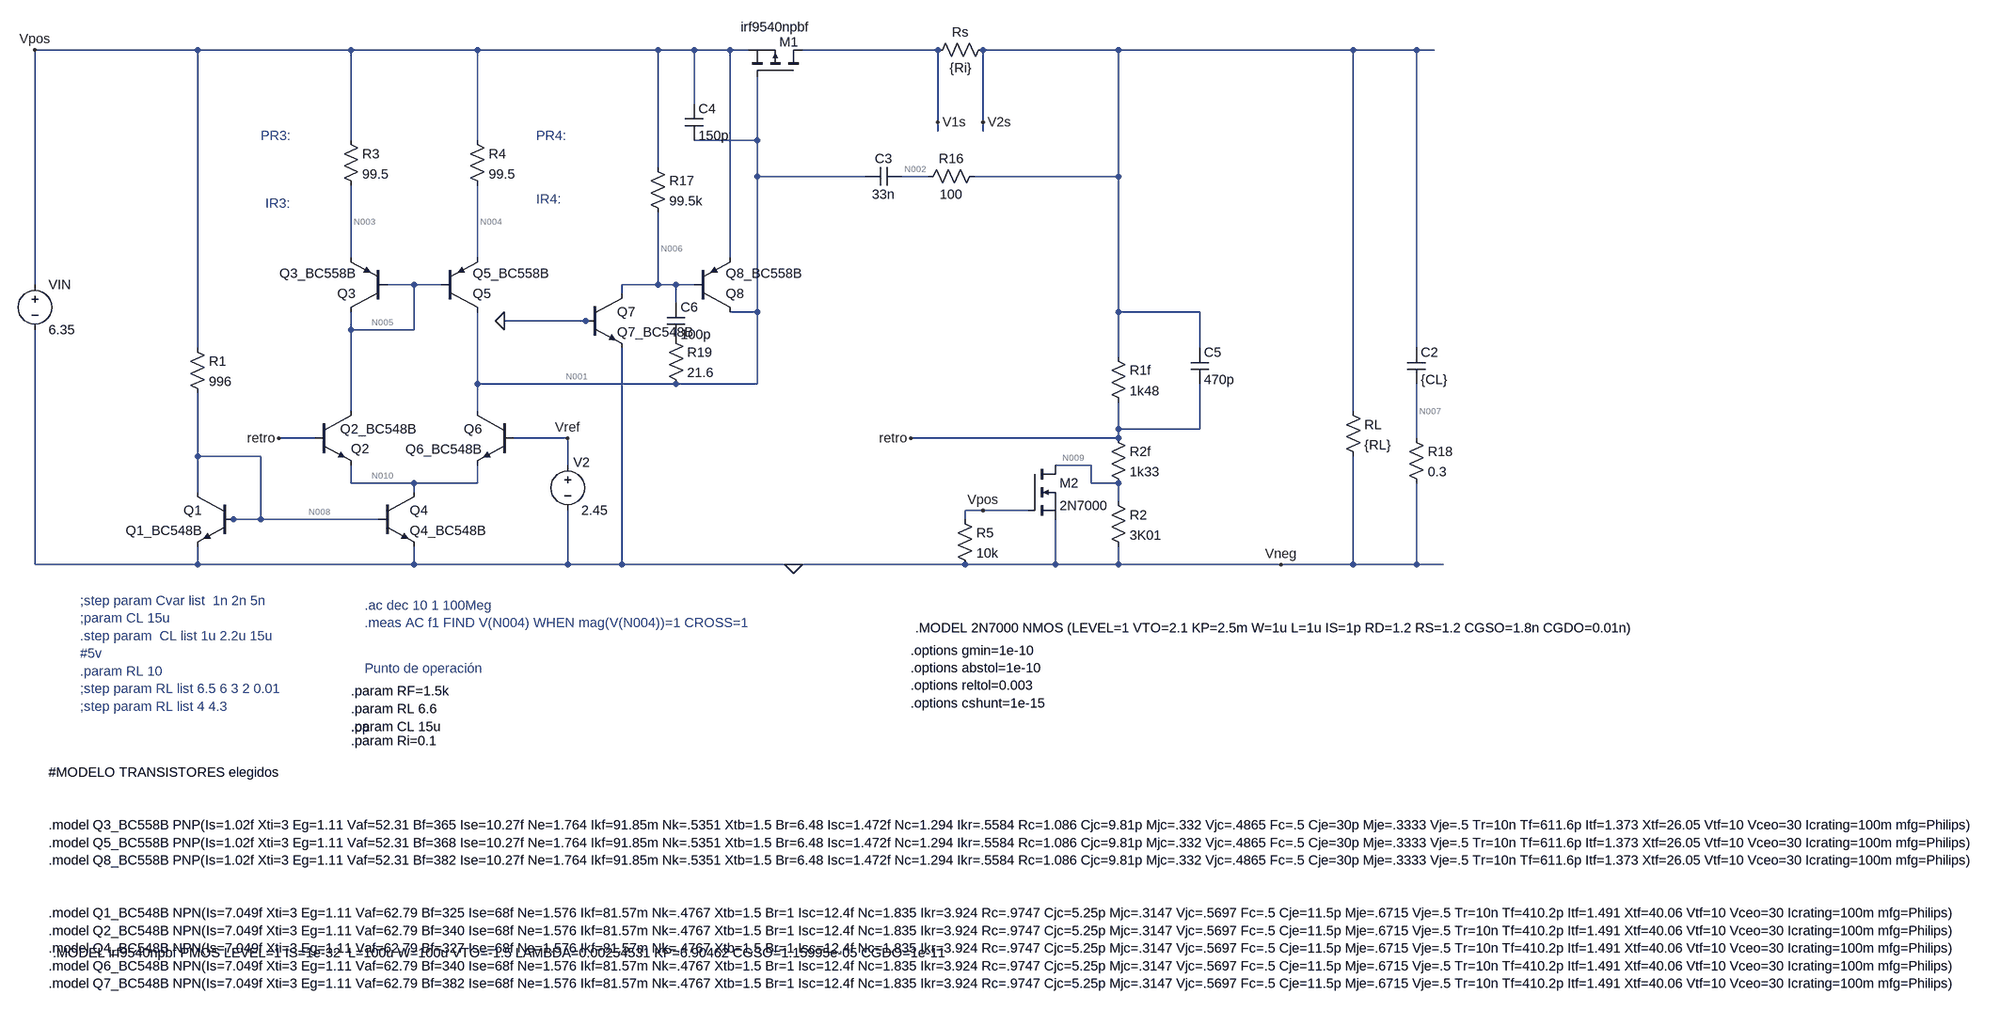
[diagram p0: schematic 2024-10-27 prueba vref caso limite.asc]
2024-10-27 prueba vref caso limite.asc, the LTspice schematic file:
Version 4
SHEET 1 6700 2000
WIRE -496 -32 -784 -32
WIRE -224 -32 -496 -32
WIRE 0 -32 -224 -32
WIRE 320 -32 0 -32
WIRE 384 -32 320 -32
WIRE 448 -32 384 -32
WIRE 480 -32 448 -32
WIRE 816 -32 576 -32
WIRE 1136 -32 896 -32
WIRE 1552 -32 1136 -32
WIRE 1664 -32 1552 -32
WIRE 1696 -32 1664 -32
WIRE 384 64 384 -32
WIRE 816 96 816 -32
WIRE 896 96 896 -32
WIRE 816 112 816 96
WIRE 896 112 896 96
WIRE -224 128 -224 -32
WIRE 0 128 0 -32
WIRE 496 128 496 16
WIRE 496 128 384 128
WIRE 320 176 320 -32
WIRE 496 192 496 128
WIRE 688 192 496 192
WIRE 800 192 752 192
WIRE 1136 192 1136 -32
WIRE 1136 192 880 192
WIRE -224 336 -224 208
WIRE 0 336 0 208
WIRE 448 336 448 -32
WIRE -784 384 -784 -32
WIRE -112 384 -160 384
WIRE -64 384 -112 384
WIRE 320 384 320 256
WIRE 320 384 256 384
WIRE 352 384 320 384
WIRE 384 384 352 384
WIRE 256 400 256 384
WIRE 352 416 352 384
WIRE 496 432 496 192
WIRE 496 432 448 432
WIRE 1136 432 1136 192
WIRE 1280 432 1136 432
WIRE 192 448 48 448
WIRE 208 448 192 448
WIRE -224 464 -224 432
WIRE -112 464 -112 384
WIRE -112 464 -224 464
WIRE -496 496 -496 -32
WIRE 1280 496 1280 432
WIRE 1664 496 1664 -32
WIRE 1136 512 1136 432
WIRE 0 560 0 432
WIRE 352 560 0 560
WIRE 496 560 496 432
WIRE 496 560 352 560
WIRE -224 608 -224 464
WIRE 0 608 0 560
WIRE 1552 608 1552 -32
WIRE 1136 640 1136 592
WIRE 1280 640 1280 560
WIRE 1280 640 1136 640
WIRE -288 656 -352 656
WIRE 160 656 64 656
WIRE 1136 656 1136 640
WIRE 1136 656 768 656
WIRE 1664 656 1664 560
WIRE -496 688 -496 576
WIRE -384 688 -496 688
WIRE 160 704 160 656
WIRE 1088 704 1024 704
WIRE -224 736 -224 704
WIRE -112 736 -224 736
WIRE 0 736 0 704
WIRE 0 736 -112 736
WIRE 1088 736 1088 704
WIRE 1136 736 1088 736
WIRE -496 752 -496 688
WIRE -112 752 -112 736
WIRE 1136 768 1136 736
WIRE 896 784 864 784
WIRE 976 784 896 784
WIRE -432 800 -448 800
WIRE -384 800 -384 688
WIRE -384 800 -432 800
WIRE -176 800 -384 800
WIRE 864 800 864 784
WIRE -784 880 -784 464
WIRE -496 880 -496 848
WIRE -496 880 -784 880
WIRE -112 880 -112 848
WIRE -112 880 -496 880
WIRE 160 880 160 784
WIRE 160 880 -112 880
WIRE 256 880 256 496
WIRE 256 880 160 880
WIRE 560 880 256 880
WIRE 864 880 560 880
WIRE 1024 880 1024 800
WIRE 1024 880 864 880
WIRE 1136 880 1136 848
WIRE 1136 880 1024 880
WIRE 1424 880 1136 880
WIRE 1552 880 1552 688
WIRE 1552 880 1424 880
WIRE 1664 880 1664 736
WIRE 1664 880 1552 880
WIRE 1712 880 1664 880
FLAG 560 880 0
FLAG -784 -32 Vpos
FLAG 816 96 V1s
FLAG 896 96 V2s
FLAG 1424 880 Vneg
FLAG 160 656 Vref
FLAG -352 656 retro
FLAG 768 656 retro
FLAG 48 448 0
FLAG 896 784 Vpos
DATAFLAG 96 -32 ""
DATAFLAG 1152 -32 ""
DATAFLAG 1152 -32 ""
DATAFLAG 1152 -32 ""
DATAFLAG -112 736 ""
DATAFLAG 160 560 ""
DATAFLAG 1136 640 ""
DATAFLAG 992 560 "(V(v2s)-V(retro))*I(R1f)"
DATAFLAG -352 176 "(V(vpos)-V(n004))*I(R3)"
DATAFLAG 160 176 "(V(vpos)-V(n004))*I(R4)"
DATAFLAG 848 -96 "(V(v2s)-V(v1s))*I(Rs)"
DATAFLAG 1456 672 "V(v2s)*I(RL)"
DATAFLAG 544 -96 "(-V(v2s)+V(vpos))*Is(M1)"
DATAFLAG -624 560 "(V(vpos)-V(n008))*I(R1)"
DATAFLAG 160 288 "-Ic(Q5)"
DATAFLAG -352 288 "-Ic(Q3)"
DATAFLAG 768 784 ""
SYMBOL res 1536 592 R0
SYMATTR InstName RL
SYMATTR Value {RL}
SYMBOL voltage -784 368 R0
WINDOW 123 24 124 Left 2
WINDOW 39 0 0 Left 0
SYMATTR InstName VIN
SYMATTR Value 6.35
SYMBOL res 1120 496 R0
SYMATTR InstName R1f
SYMATTR Value 1k48
SYMBOL res 1120 640 R0
SYMATTR InstName R2f
SYMATTR Value 1k33
SYMBOL res 912 -48 R90
WINDOW 0 0 56 VBottom 2
WINDOW 3 32 56 VTop 2
SYMATTR InstName Rs
SYMATTR Value {Ri}
SYMBOL pnp -160 432 R180
SYMATTR InstName Q3
SYMATTR Value Q3_BC558B
SYMBOL pnp -64 432 M180
SYMATTR InstName Q5
SYMATTR Value Q5_BC558B
SYMBOL npn -288 608 R0
WINDOW 0 64 67 Left 2
WINDOW 3 45 32 Left 2
SYMATTR InstName Q2
SYMATTR Value Q2_BC548B
SYMBOL npn 64 608 M0
SYMATTR InstName Q6
SYMATTR Value Q6_BC548B
SYMBOL res -240 112 R0
SYMATTR InstName R3
SYMATTR Value 99.5
SYMBOL res -16 112 R0
SYMATTR InstName R4
SYMATTR Value 99.5
SYMBOL res -512 480 R0
SYMATTR InstName R1
SYMATTR Value 996
SYMBOL npn -432 752 M0
SYMATTR InstName Q1
SYMATTR Value Q1_BC548B
SYMBOL npn -176 752 R0
SYMATTR InstName Q4
SYMATTR Value Q4_BC548B
SYMBOL pmos 576 16 M270
WINDOW 0 62 41 VLeft 2
WINDOW 3 89 109 VLeft 2
SYMATTR InstName M1
SYMATTR Value irf9540npbf
SYMBOL voltage 160 688 R0
WINDOW 0 10 11 Left 2
SYMATTR InstName V2
SYMATTR Value 2.45
SYMBOL pnp 384 432 M180
SYMATTR InstName Q8
SYMATTR Value Q8_BC558B
SYMBOL npn 192 400 R0
SYMATTR InstName Q7
SYMATTR Value Q7_BC548B
SYMBOL res 304 160 R0
SYMATTR InstName R17
SYMATTR Value 99.5k
SYMBOL cap 1648 496 R0
SYMATTR InstName C2
SYMATTR Value {CL}
SYMBOL cap 752 176 R90
WINDOW 0 0 32 VBottom 2
WINDOW 3 32 32 VTop 2
SYMATTR InstName C3
SYMATTR Value 33n
SYMBOL res 896 176 R90
WINDOW 0 0 56 VBottom 2
WINDOW 3 32 56 VTop 2
SYMATTR InstName R16
SYMATTR Value 100
SYMBOL cap 368 64 R0
SYMATTR InstName C4
SYMATTR Value 150p
SYMBOL cap 1264 496 R0
SYMATTR InstName C5
SYMATTR Value 470p
SYMBOL res 1648 640 R0
SYMATTR InstName R18
SYMATTR Value 0.3
SYMBOL cap 336 416 R0
SYMATTR InstName C6
SYMATTR Value 100p
SYMBOL res 336 464 R0
SYMATTR InstName R19
SYMATTR Value 21.6
SYMBOL nmos 976 704 R0
SYMATTR InstName M2
SYMATTR Value 2N7000
SYMBOL res 1120 752 R0
SYMATTR InstName R2
SYMATTR Value 3K01
SYMBOL res 848 784 R0
SYMATTR InstName R5
SYMATTR Value 10k
TEXT -224 1168 Left 2 !.op
TEXT -752 1568 Left 2 !.MODEL irf9540npbf PMOS LEVEL=1 IS=1e-32  L=100u W=100u VTO=-1.5 LAMBDA=0.00254531 KP=6.90462 CGSO=1.15995e-05 CGDO=1e-11
TEXT -224 1136 Left 2 !.param RL 6.6\n.param CL 15u
TEXT -224 1104 Left 2 !.param RF=1.5k
TEXT -200 1064 Left 2 ;Punto de operación
TEXT -224 1192 Left 2 !.param Ri=0.1
TEXT -760 1248 Left 2 !#MODELO TRANSISTORES elegidos\n \n\n.model Q3_BC558B PNP(Is=1.02f Xti=3 Eg=1.11 Vaf=52.31 Bf=365 Ise=10.27f Ne=1.764 Ikf=91.85m Nk=.5351 Xtb=1.5 Br=6.48 Isc=1.472f Nc=1.294 Ikr=.5584 Rc=1.086 Cjc=9.81p Mjc=.332 Vjc=.4865 Fc=.5 Cje=30p Mje=.3333 Vje=.5 Tr=10n Tf=611.6p Itf=1.373 Xtf=26.05 Vtf=10 Vceo=30 Icrating=100m mfg=Philips)\n.model Q5_BC558B PNP(Is=1.02f Xti=3 Eg=1.11 Vaf=52.31 Bf=368 Ise=10.27f Ne=1.764 Ikf=91.85m Nk=.5351 Xtb=1.5 Br=6.48 Isc=1.472f Nc=1.294 Ikr=.5584 Rc=1.086 Cjc=9.81p Mjc=.332 Vjc=.4865 Fc=.5 Cje=30p Mje=.3333 Vje=.5 Tr=10n Tf=611.6p Itf=1.373 Xtf=26.05 Vtf=10 Vceo=30 Icrating=100m mfg=Philips)\n.model Q8_BC558B PNP(Is=1.02f Xti=3 Eg=1.11 Vaf=52.31 Bf=382 Ise=10.27f Ne=1.764 Ikf=91.85m Nk=.5351 Xtb=1.5 Br=6.48 Isc=1.472f Nc=1.294 Ikr=.5584 Rc=1.086 Cjc=9.81p Mjc=.332 Vjc=.4865 Fc=.5 Cje=30p Mje=.3333 Vje=.5 Tr=10n Tf=611.6p Itf=1.373 Xtf=26.05 Vtf=10 Vceo=30 Icrating=100m mfg=Philips)\n \n\n.model Q1_BC548B NPN(Is=7.049f Xti=3 Eg=1.11 Vaf=62.79 Bf=325 Ise=68f Ne=1.576 Ikf=81.57m Nk=.4767 Xtb=1.5 Br=1 Isc=12.4f Nc=1.835 Ikr=3.924 Rc=.9747 Cjc=5.25p Mjc=.3147 Vjc=.5697 Fc=.5 Cje=11.5p Mje=.6715 Vje=.5 Tr=10n Tf=410.2p Itf=1.491 Xtf=40.06 Vtf=10 Vceo=30 Icrating=100m mfg=Philips)\n.model Q2_BC548B NPN(Is=7.049f Xti=3 Eg=1.11 Vaf=62.79 Bf=340 Ise=68f Ne=1.576 Ikf=81.57m Nk=.4767 Xtb=1.5 Br=1 Isc=12.4f Nc=1.835 Ikr=3.924 Rc=.9747 Cjc=5.25p Mjc=.3147 Vjc=.5697 Fc=.5 Cje=11.5p Mje=.6715 Vje=.5 Tr=10n Tf=410.2p Itf=1.491 Xtf=40.06 Vtf=10 Vceo=30 Icrating=100m mfg=Philips)\n.model Q4_BC548B NPN(Is=7.049f Xti=3 Eg=1.11 Vaf=62.79 Bf=327 Ise=68f Ne=1.576 Ikf=81.57m Nk=.4767 Xtb=1.5 Br=1 Isc=12.4f Nc=1.835 Ikr=3.924 Rc=.9747 Cjc=5.25p Mjc=.3147 Vjc=.5697 Fc=.5 Cje=11.5p Mje=.6715 Vje=.5 Tr=10n Tf=410.2p Itf=1.491 Xtf=40.06 Vtf=10 Vceo=30 Icrating=100m mfg=Philips)\n.model Q6_BC548B NPN(Is=7.049f Xti=3 Eg=1.11 Vaf=62.79 Bf=340 Ise=68f Ne=1.576 Ikf=81.57m Nk=.4767 Xtb=1.5 Br=1 Isc=12.4f Nc=1.835 Ikr=3.924 Rc=.9747 Cjc=5.25p Mjc=.3147 Vjc=.5697 Fc=.5 Cje=11.5p Mje=.6715 Vje=.5 Tr=10n Tf=410.2p Itf=1.491 Xtf=40.06 Vtf=10 Vceo=30 Icrating=100m mfg=Philips)\n.model Q7_BC548B NPN(Is=7.049f Xti=3 Eg=1.11 Vaf=62.79 Bf=382 Ise=68f Ne=1.576 Ikf=81.57m Nk=.4767 Xtb=1.5 Br=1 Isc=12.4f Nc=1.835 Ikr=3.924 Rc=.9747 Cjc=5.25p Mjc=.3147 Vjc=.5697 Fc=.5 Cje=11.5p Mje=.6715 Vje=.5 Tr=10n Tf=410.2p Itf=1.491 Xtf=40.06 Vtf=10 Vceo=30 Icrating=100m mfg=Philips)
TEXT -200 952 Left 2 ;.ac dec 10 1 100Meg\n.meas AC f1 FIND V(N004) WHEN mag(V(N004))=1 CROSS=1
TEXT -704 944 Left 2 ;;step param Cvar list  1n 2n 5n\n;param CL 15u\n.step param  CL list 1u 2.2u 15u\n#5v\n.param RL 10\n;step param RL list 6.5 6 3 2 0.01\n;step param RL list 4 4.3
TEXT 768 1032 Left 2 !.options gmin=1e-10\n.options abstol=1e-10\n.options reltol=0.003\n.options cshunt=1e-15
TEXT -384 120 Left 2 ;PR3:
TEXT -376 240 Left 2 ;IR3:
TEXT 104 120 Left 2 ;PR4:
TEXT 104 232 Left 2 ;IR4:
TEXT 776 992 Left 2 !.MODEL 2N7000 NMOS (LEVEL=1 VTO=2.1 KP=2.5m W=1u L=1u IS=1p RD=1.2 RS=1.2 CGSO=1.8n CGDO=0.01n)

The netlist it stands for:
* 2024-10-27 prueba vref caso limite.asc
RL V2s 0 {RL}
VIN Vpos 0 6.35
R1f V2s retro 1k48
R2f retro N009 1k33
Rs V2s V1s {Ri}
Q3 N005 N005 N003 0 Q3_BC558B
Q5 N001 N005 N004 0 Q5_BC558B
Q2 N005 retro N010 0 Q2_BC548B
Q6 N001 Vref N010 0 Q6_BC548B
R3 Vpos N003 99.5
R4 Vpos N004 99.5
R1 Vpos N008 996
Q1 N008 N008 0 0 Q1_BC548B
Q4 N010 N008 0 0 Q4_BC548B
M1 V1s N001 Vpos Vpos irf9540npbf
V2 Vref 0 2.45
Q8 N001 N006 Vpos 0 Q8_BC558B
Q7 N006 0 0 0 Q7_BC548B
R17 Vpos N006 99.5k
C2 V2s N007 {CL}
C3 N002 N001 33n
R16 V2s N002 100
C4 Vpos N001 150p
C5 V2s retro 470p
R18 N007 0 0.3
C6 N006 P001 100p
R19 P001 N001 21.6
M2 N009 Vpos 0 0 2N7000
R2 N009 0 3K01
R5 Vpos 0 10k
.model NPN NPN
.model PNP PNP
.lib standard.bjt
.model NMOS NMOS
.model PMOS PMOS
.lib standard.mos
.op
.MODEL irf9540npbf PMOS LEVEL=1 IS=1e-32  L=100u W=100u VTO=-1.5 LAMBDA=0.00254531 KP=6.90462 CGSO=1.15995e-05 CGDO=1e-11
.param RL 6.6
.param CL 15u
.param RF=1.5k
* Punto de operación
.param Ri=0.1
#MODELO TRANSISTORES elegidos
.model Q3_BC558B PNP(Is=1.02f Xti=3 Eg=1.11 Vaf=52.31 Bf=365 Ise=10.27f Ne=1.764 Ikf=91.85m Nk=.5351 Xtb=1.5 Br=6.48 Isc=1.472f Nc=1.294 Ikr=.5584 Rc=1.086 Cjc=9.81p Mjc=.332 Vjc=.4865 Fc=.5 Cje=30p Mje=.3333 Vje=.5 Tr=10n Tf=611.6p Itf=1.373 Xtf=26.05 Vtf=10 Vceo=30 Icrating=100m mfg=Philips)
.model Q5_BC558B PNP(Is=1.02f Xti=3 Eg=1.11 Vaf=52.31 Bf=368 Ise=10.27f Ne=1.764 Ikf=91.85m Nk=.5351 Xtb=1.5 Br=6.48 Isc=1.472f Nc=1.294 Ikr=.5584 Rc=1.086 Cjc=9.81p Mjc=.332 Vjc=.4865 Fc=.5 Cje=30p Mje=.3333 Vje=.5 Tr=10n Tf=611.6p Itf=1.373 Xtf=26.05 Vtf=10 Vceo=30 Icrating=100m mfg=Philips)
.model Q8_BC558B PNP(Is=1.02f Xti=3 Eg=1.11 Vaf=52.31 Bf=382 Ise=10.27f Ne=1.764 Ikf=91.85m Nk=.5351 Xtb=1.5 Br=6.48 Isc=1.472f Nc=1.294 Ikr=.5584 Rc=1.086 Cjc=9.81p Mjc=.332 Vjc=.4865 Fc=.5 Cje=30p Mje=.3333 Vje=.5 Tr=10n Tf=611.6p Itf=1.373 Xtf=26.05 Vtf=10 Vceo=30 Icrating=100m mfg=Philips)
.model Q1_BC548B NPN(Is=7.049f Xti=3 Eg=1.11 Vaf=62.79 Bf=325 Ise=68f Ne=1.576 Ikf=81.57m Nk=.4767 Xtb=1.5 Br=1 Isc=12.4f Nc=1.835 Ikr=3.924 Rc=.9747 Cjc=5.25p Mjc=.3147 Vjc=.5697 Fc=.5 Cje=11.5p Mje=.6715 Vje=.5 Tr=10n Tf=410.2p Itf=1.491 Xtf=40.06 Vtf=10 Vceo=30 Icrating=100m mfg=Philips)
.model Q2_BC548B NPN(Is=7.049f Xti=3 Eg=1.11 Vaf=62.79 Bf=340 Ise=68f Ne=1.576 Ikf=81.57m Nk=.4767 Xtb=1.5 Br=1 Isc=12.4f Nc=1.835 Ikr=3.924 Rc=.9747 Cjc=5.25p Mjc=.3147 Vjc=.5697 Fc=.5 Cje=11.5p Mje=.6715 Vje=.5 Tr=10n Tf=410.2p Itf=1.491 Xtf=40.06 Vtf=10 Vceo=30 Icrating=100m mfg=Philips)
.model Q4_BC548B NPN(Is=7.049f Xti=3 Eg=1.11 Vaf=62.79 Bf=327 Ise=68f Ne=1.576 Ikf=81.57m Nk=.4767 Xtb=1.5 Br=1 Isc=12.4f Nc=1.835 Ikr=3.924 Rc=.9747 Cjc=5.25p Mjc=.3147 Vjc=.5697 Fc=.5 Cje=11.5p Mje=.6715 Vje=.5 Tr=10n Tf=410.2p Itf=1.491 Xtf=40.06 Vtf=10 Vceo=30 Icrating=100m mfg=Philips)
.model Q6_BC548B NPN(Is=7.049f Xti=3 Eg=1.11 Vaf=62.79 Bf=340 Ise=68f Ne=1.576 Ikf=81.57m Nk=.4767 Xtb=1.5 Br=1 Isc=12.4f Nc=1.835 Ikr=3.924 Rc=.9747 Cjc=5.25p Mjc=.3147 Vjc=.5697 Fc=.5 Cje=11.5p Mje=.6715 Vje=.5 Tr=10n Tf=410.2p Itf=1.491 Xtf=40.06 Vtf=10 Vceo=30 Icrating=100m mfg=Philips)
.model Q7_BC548B NPN(Is=7.049f Xti=3 Eg=1.11 Vaf=62.79 Bf=382 Ise=68f Ne=1.576 Ikf=81.57m Nk=.4767 Xtb=1.5 Br=1 Isc=12.4f Nc=1.835 Ikr=3.924 Rc=.9747 Cjc=5.25p Mjc=.3147 Vjc=.5697 Fc=.5 Cje=11.5p Mje=.6715 Vje=.5 Tr=10n Tf=410.2p Itf=1.491 Xtf=40.06 Vtf=10 Vceo=30 Icrating=100m mfg=Philips)
* .ac dec 10 1 100Meg
* .meas AC f1 FIND V(N004) WHEN mag(V(N004))=1 CROSS=1
* ;step param Cvar list  1n 2n 5n
* ;param CL 15u
* .step param  CL list 1u 2.2u 15u
* #5v
* .param RL 10
* ;step param RL list 6.5 6 3 2 0.01
* ;step param RL list 4 4.3
.options gmin=1e-10
.options abstol=1e-10
.options reltol=0.003
.options cshunt=1e-15
* PR3:
* IR3:
* PR4:
* IR4:
.MODEL 2N7000 NMOS (LEVEL=1 VTO=2.1 KP=2.5m W=1u L=1u IS=1p RD=1.2 RS=1.2 CGSO=1.8n CGDO=0.01n)
.backanno
.end

* Results of the author's LTspice run, read from the files saved beside the schematic
* Operating Point:
*   V(v2s) = 5.008 V
*   V(vpos) = 6.35 V
*   V(retro) = 2.45 V
*   V(n009) = 163.7 mV
*   V(v1s) = 5.084 V
*   V(n005) = 5.325 V
*   V(n003) = 6.067 V
*   V(n001) = 4.381 V
*   V(n004) = 6.066 V
*   V(n010) = 1.759 V
*   V(vref) = 2.45 V
*   V(n008) = 710.5 mV
*   V(n006) = 6.35 V
*   V(n007) = 0 V
*   V(n002) = 5.008 V
*   V(p001) = 4.381 V
*   Ic(Q3) = -2.837 mA
*   Ib(Q3) = -8.15 µA
*   Ie(Q3) = 2.845 mA
*   Ic(Q5) = -2.841 mA
*   Ib(Q5) = -7.95 µA
*   Ie(Q5) = 2.849 mA
*   Ic(Q2) = 2.853 mA
*   Ib(Q2) = 9.841 µA
*   Ie(Q2) = -2.863 mA
*   Ic(Q6) = 2.841 mA
*   Ib(Q6) = 9.942 µA
*   Ie(Q6) = -2.851 mA
*   Ic(Q1) = 5.62 mA
*   Ib(Q1) = 20.95 µA
*   Ie(Q1) = -5.641 mA
*   Ic(Q4) = 5.714 mA
*   Ib(Q4) = 20.83 µA
*   Ie(Q4) = -5.735 mA
*   Ic(Q8) = -196.9 pA
*   Ib(Q8) = 196.8 pA
*   Ie(Q8) = 9.357 fA
*   Ic(Q7) = 635 pA
*   Ib(Q7) = -635 pA
*   Ie(Q7) = -7.762 fA
*   Id(M1) = -760.5 mA
*   Ig(M1) = 0 A
*   Ib(M1) = 126.6 pA
*   Is(M1) = 760.5 mA
*   Id(M2) = 1.664 mA
*   Ig(M2) = 0 A
*   Ib(M2) = -17.44 pA
*   Is(M2) = -1.664 mA
*   I(C2) = 0 A
*   I(C3) = 0 A
*   I(C4) = 0 A
*   I(C5) = 0 A
*   I(C6) = 0 A
*   I(Rl) = 758.8 mA
*   I(R1f) = 1.729 mA
*   I(R2f) = 1.719 mA
*   I(Rs) = -760.5 mA
*   I(R3) = 2.845 mA
*   I(R4) = 2.849 mA
*   I(R1) = 5.662 mA
*   I(R17) = 831.9 pA
*   I(R16) = 0 A
*   I(R18) = 0 A
*   I(R19) = 0 A
*   I(R2) = 54.39 µA
*   I(R5) = 635 µA
*   I(Vin) = -772.5 mA
*   I(V2) = -9.942 µA
* From the log:
*   Semiconductor Device Operating Points:
*                           --- Bipolar Transistors ---
*   Name:       q3          q5          q2          q6          q1
*   Model:   q3_bc558b   q5_bc558b   q2_bc548b   q6_bc548b   q1_bc548b
*   Ib:      -8.15e-06   -7.95e-06    9.84e-06    9.94e-06    2.09e-05
*   Ic:      -2.84e-03   -2.84e-03    2.85e-03    2.84e-03    5.62e-03
*   Vbe:     -7.42e-01   -7.42e-01    6.91e-01    6.91e-01    7.10e-01
*   Vbc:      0.00e+00    9.44e-01   -2.88e+00   -1.93e+00    0.00e+00
*   Vce:     -7.42e-01   -1.69e+00    3.57e+00    2.62e+00    7.10e-01
*   BetaDC:   3.48e+02    3.57e+02    2.90e+02    2.86e+02    2.68e+02
*   Gm:       1.06e-01    1.06e-01    1.07e-01    1.07e-01    2.05e-01
*   Rpi:      3.19e+03    3.27e+03    2.79e+03    2.76e+03    1.29e+03
*   Rx:       0.00e+00    0.00e+00    0.00e+00    0.00e+00    0.00e+00
*   Ro:       1.84e+04    1.87e+04    2.30e+04    2.28e+04    1.12e+04
*   Cbe:      1.28e-10    1.28e-10    8.39e-11    8.37e-11    1.25e-10
*   Cbc:      9.83e-12    6.86e-12    2.98e-12    3.30e-12    5.27e-12
*   Cjs:      0.00e+00    0.00e+00    0.00e+00    0.00e+00    0.00e+00
*   BetaAC:   3.39e+02    3.48e+02    2.98e+02    2.94e+02    2.64e+02
*   Cbx:      0.00e+00    0.00e+00    0.00e+00    0.00e+00    0.00e+00
*   Ft:       1.23e+08    1.26e+08    1.96e+08    1.95e+08    2.50e+08
*   Name:       q4          q8          q7
*   Model:   q4_bc548b   q8_bc558b   q7_bc548b
*   Ib:       2.08e-05    1.97e-10   -6.35e-10
*   Ic:       5.71e-03   -1.97e-10    6.35e-10
*   Vbe:      7.10e-01   -8.28e-05    0.00e+00
*   Vbc:     -1.05e+00    1.97e+00   -6.35e+00
*   Vce:      1.76e+00   -1.97e+00    6.35e+00
*   BetaDC:   2.74e+02   -1.00e+00   -1.00e+00
*   Gm:       2.08e-01    4.10e-14    3.00e-13
*   Rpi:      1.30e+03    9.98e+09    9.84e+09
*   Rx:       0.00e+00    0.00e+00    0.00e+00
*   Ro:       1.12e+04    5.11e+16    8.91e+15
*   Cbe:      1.27e-10    3.00e-11    1.15e-11
*   Cbc:      3.78e-12    5.73e-12    2.39e-12
*   Cjs:      0.00e+00    0.00e+00    0.00e+00
*   BetaAC:   2.70e+02    4.09e-04    2.95e-03
*   Cbx:      0.00e+00    0.00e+00    0.00e+00
*   Ft:       2.54e+08    4.46e-01    1.16e+00
*                           --- MOSFET Transistors ---
*   Name:          m1          m2
*   Model:     irf9540npbf   2n7000
*   Id:         -7.61e-01    1.66e-03
*   Vgs:        -1.97e+00    6.35e+00
*   Vds:        -1.27e+00    1.64e-01
*   Vbs:         0.00e+00    0.00e+00
*   Vth:        -1.50e+00    2.10e+00
*   Vdsat:      -4.69e-01    4.25e+00
*   Gm:          3.25e+00    3.99e-04
*   Gds:         1.93e-03    1.02e-02
*   Gmb:         0.00e+00    0.00e+00
*   Cbd:         0.00e+00    0.00e+00
*   Cbs:         0.00e+00    0.00e+00
*   Cgsov:       1.16e-09    1.80e-15
*   Cgdov:       1.00e-15    1.00e-17
*   Cgbov:       0.00e+00    0.00e+00
*   Cgs:         0.00e+00    0.00e+00
*   Cgd:         0.00e+00    0.00e+00
*   Cgb:         0.00e+00    0.00e+00